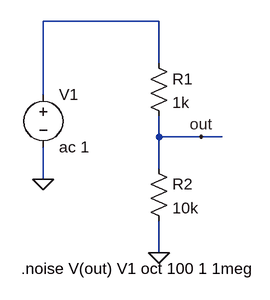
[diagram p0: schematic noise.asc]
noise.asc, the LTspice schematic file:
Version 4
SHEET 1 880 680
WIRE 240 144 64 144
WIRE 240 208 240 144
WIRE 64 256 64 144
WIRE 240 320 240 288
WIRE 304 320 240 320
WIRE 336 320 304 320
WIRE 240 368 240 320
WIRE 64 384 64 336
WIRE 240 496 240 448
FLAG 64 384 0
FLAG 240 496 0
FLAG 304 320 out
SYMBOL res 224 192 R0
SYMATTR InstName R1
SYMATTR Value 1k
SYMBOL res 224 352 R0
SYMATTR InstName R2
SYMATTR Value 10k
SYMBOL voltage 64 240 R0
WINDOW 123 0 0 Left 2
WINDOW 39 0 0 Left 2
SYMATTR InstName V1
SYMATTR Value ac 1
TEXT 30 520 Left 2 !.noise V(out) V1 oct 100 1 1meg

The netlist it stands for:
* noise.asc
R1 N001 out 1k
R2 out 0 10k
V1 N001 0 ac 1
.noise V(out) V1 oct 100 1 1meg
.backanno
.end